# Altium schematic sheet Conectores.SchDoc: Conectores
size A4; Date: 12/03/2026; Author: Daniel & David; CompanyName: UPM; DrawnBy: Daniel & David; Engineer: Daniel & David; Organization: ETSIT; Revision: V1
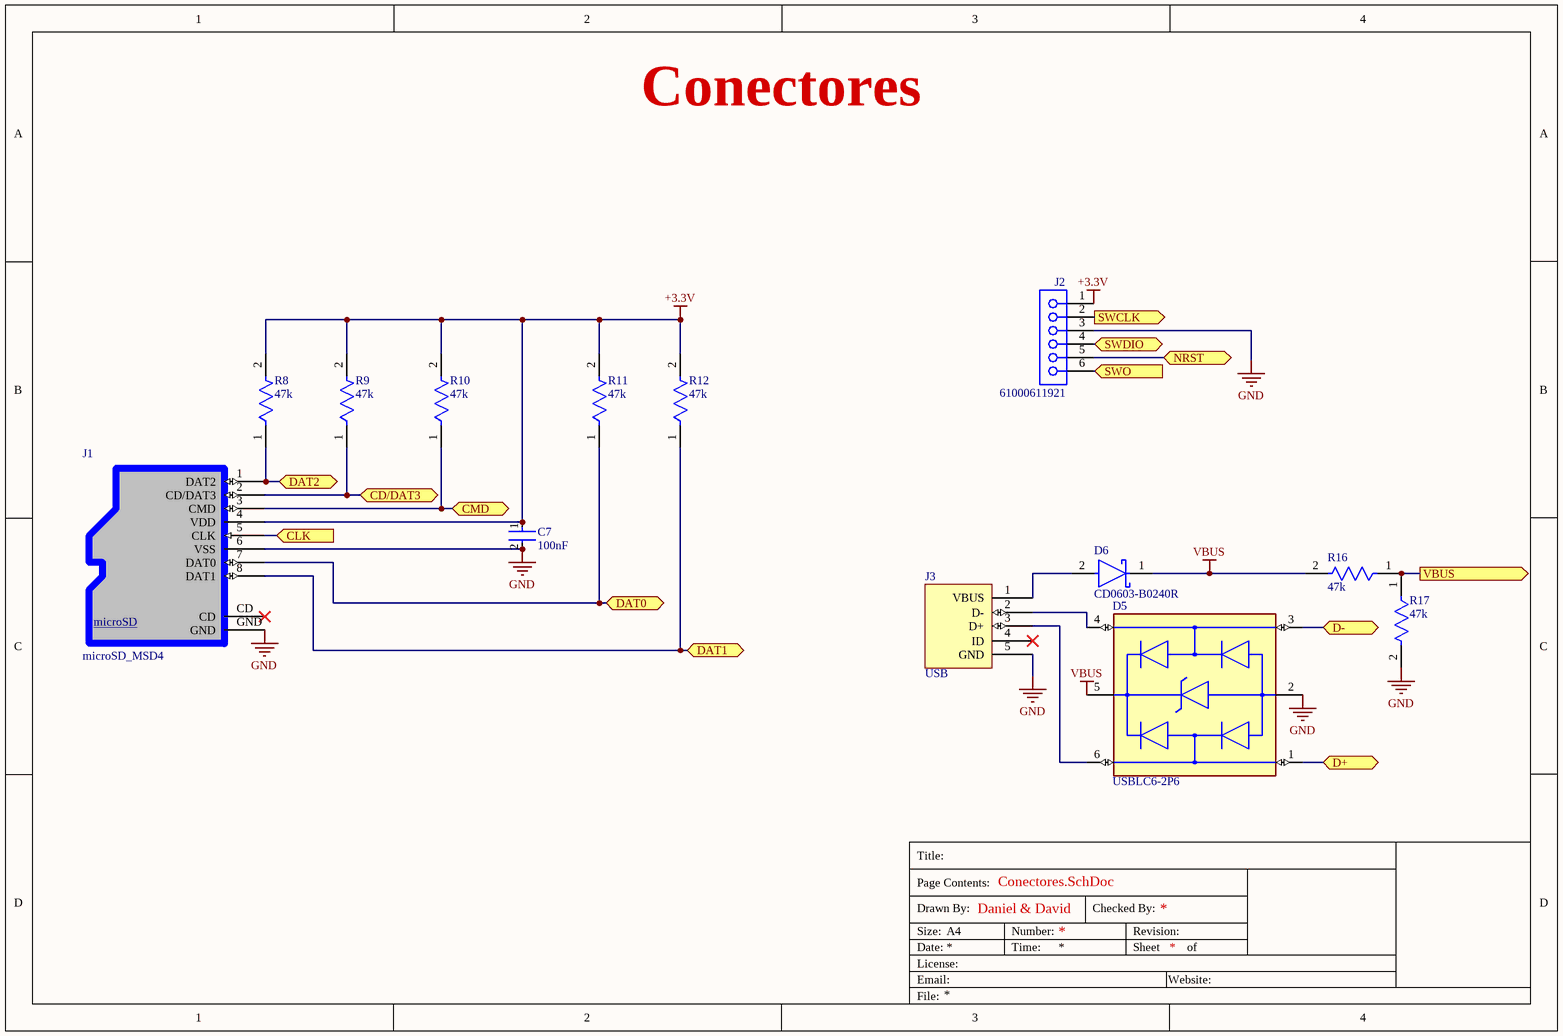
[diagram p0: Conectores.SchDoc]

## Parts
C7  100nF  [FP-GCG188-0_2-IPC_B]
D5  USBLC6-2P6  [FP-SOT-666-MFG]
D6  CD0603-B0240R  [FP-CD0603-MFG]
J1  microSD_MSD4  [ConnectorMicroSD_msd4]
J2  61000611921  [61000611921]
J3  USB  [ConnectorMicroUSB]
R8  47k  [FP-TFCR0603-IPC_A]
R9  47k  [FP-TFCR0603-IPC_A]
R10  47k  [FP-TFCR0603-IPC_A]
R11  47k  [FP-TFCR0603-IPC_A]
R12  47k  [FP-TFCR0603-IPC_A]
R16  47k  [FP-TFCR0603-IPC_A]
R17  47k  [FP-TFCR0603-IPC_A]

## Ports
CD/DAT3 (bidir), CLK (in), CMD (bidir), D+ (bidir), D- (bidir), DAT0 (bidir), DAT1 (bidir), DAT2 (bidir), NRST (bidir), SWCLK (out), SWDIO (bidir), SWO (in), VBUS (out)

## Nets
+3.3V: C7.1 J1.4(VDD) J2.1 R8.2 R9.2 R10.2 R11.2 R12.2
GND: C7.2 D5.2(GND) J1.6(VSS) J1.GND J2.3 J3.5(GND) R17.2
VBUS: D5.5(VBUS) D6.1(C) R16.2
CD/DAT3: J1.2(CD/DAT3) R9.1 ; port CD/DAT3
CLK: J1.5(CLK) ; port CLK
CMD: J1.3(CMD) R10.1 ; port CMD
D+: D5.1(I/O1) ; port D+
D-: D5.3(I/O2) ; port D-
DAT0: J1.7(DAT0) R11.1 ; port DAT0
DAT1: J1.8(DAT1) R12.1 ; port DAT1
DAT2: J1.1(DAT2) R8.1 ; port DAT2
NRST: J2.5 ; port NRST
SWCLK: J2.2 ; port SWCLK
SWDIO: J2.4 ; port SWDIO
SWO: J2.6 ; port SWO
VBUS: R16.1 R17.1 ; port VBUS  [a separate net that carries the same name]
NetD5_4: D5.4(I/O2) J3.2(D-)
NetD5_6: D5.6(I/O1) J3.3(D+)
NetD6_2: D6.2(A) J3.1(VBUS)

Not connected (* = marked no-connect by the designer): J1 CD*; J3 4(ID)*

## Notes on the sheet
- Title:
- Drawn By:
- Page Contents:
- Checked By:
- Size:
- Date:
- File:
- License:
- Email:
- A4
- Number:
- Time:
- Revision:
- Sheet
- Website:
- of
- (in symbol microSD_MSD4) microSD

## Library data of the parts
C7 = CMP-06035-011350-1: AgPd Termination Conductive Glue Mounting Chip Multilayer Ceramic Capacitors for Automotive 0.1uF with 20% as tolerance, 50V X8R 15%, 0603 Package
D5 = CMP-12225-000058-1: TVS DIODE 5.25V 17V SOT666; Min Breakdown Voltage: 6V; Power Line Protection: Yes; Element Configuration: Dual; Test Current: 1mA; Working Voltage: 5V; Number of Channels: 2; Max Reverse Leakage Current: 150nA; Direction: Unidirectional; Peak Pulse Current: 5A; Number of Elements: 1; Capacitance: 3.5pF; Max Breakdown Voltage: 6V; Height: 0.6mm; Depth: 1.3mm; Contact Plating: Tin; Reverse Breakdown Voltage: 6V; REACH SVHC: No SVHC; Operating Supply Voltage: 5V; Width: 1.3mm; Max Operating Temperature: 125°C; Reverse Standoff Voltage: 5V; ESD Protection: Yes; Package Quantity: 1; Termination: SMD/SMT; Length: 1.7mm; Leakage Current: 150nA; Number of Bidirectional Channels: 2; Case/Package: SOT-666; Min Operating Temperature: -40°C; Number of Pins: 6; Clamping Voltage: 17V; Breakdown Voltage: 6V; Lead Free: Lead Free; Radiation Hardening: No; Packaging: Tape and Reel; Mount: Surface Mount; Polarity: Unidirectional
D6 = CMP-07363-000001-1: DIODE SCHOTTKY 40V 200MA 0603; Manufacturer: Bourns; Standoff Height: 0.03mm; Max Surge Forward Current: 2A; Capacitance: 35pF; Max Junction Temp: +125°C; Value: 35pF; Peak Reverse Current: 0.5uA; Forward Current: 200mA; Max Repetitive Reverse Voltage: 40V; Mouser Description: Diode Small Signal Schottky 40V 0.2A Automotive 2-Pin Case 0603(1608Metric) T/R; ComponentLink2URL: https://bourns.com/data/global/pdfs/CD0603-B.pdf; ComponentLink2Description: Datasheet; Device Class L1: Discrete Semiconductors; Device Class L2: Diodes; Temperature: -40°C to +125°C; Automotive: No; Manufacturer Part Number: CD0603-B0240R; RoHS: TRUE; Height: 0.86mm; Octopart: https://octopart.com/cd0603-b0240r-bourns-87497736; Category: Diode; Temperature Range Low: -40°C; Digikey Description: DIODE SCHOTTKY 40V 200MA 0603; Device Class L3: Schottky Diodes; Temperature Range High: +125°C; Package: CD0603; Lead Free: Yes
J2 = CMP-1502-01270-4: SMT Vertical Socket Header WR-PHD, Pitch 2.54 mm, Single Row, 6 pins; Current Rating: 3A; Contact Resistance: 20mΩ; Operating Supply Voltage: 250V; Gender: Female; Lead Pitch: 2.54mm; Orientation: Vertical; Number of Pins: 6; RoHS: Non-Compliant
R8-R12 R16 R17 = CMP-250906-272076-1: RES Thin Film,  47kΩ, 1%, 0.1W, 100ppm/°C, 0603